# EAGLE schematic SchematicMasterModulePCB (EAGLE 9.7.0)
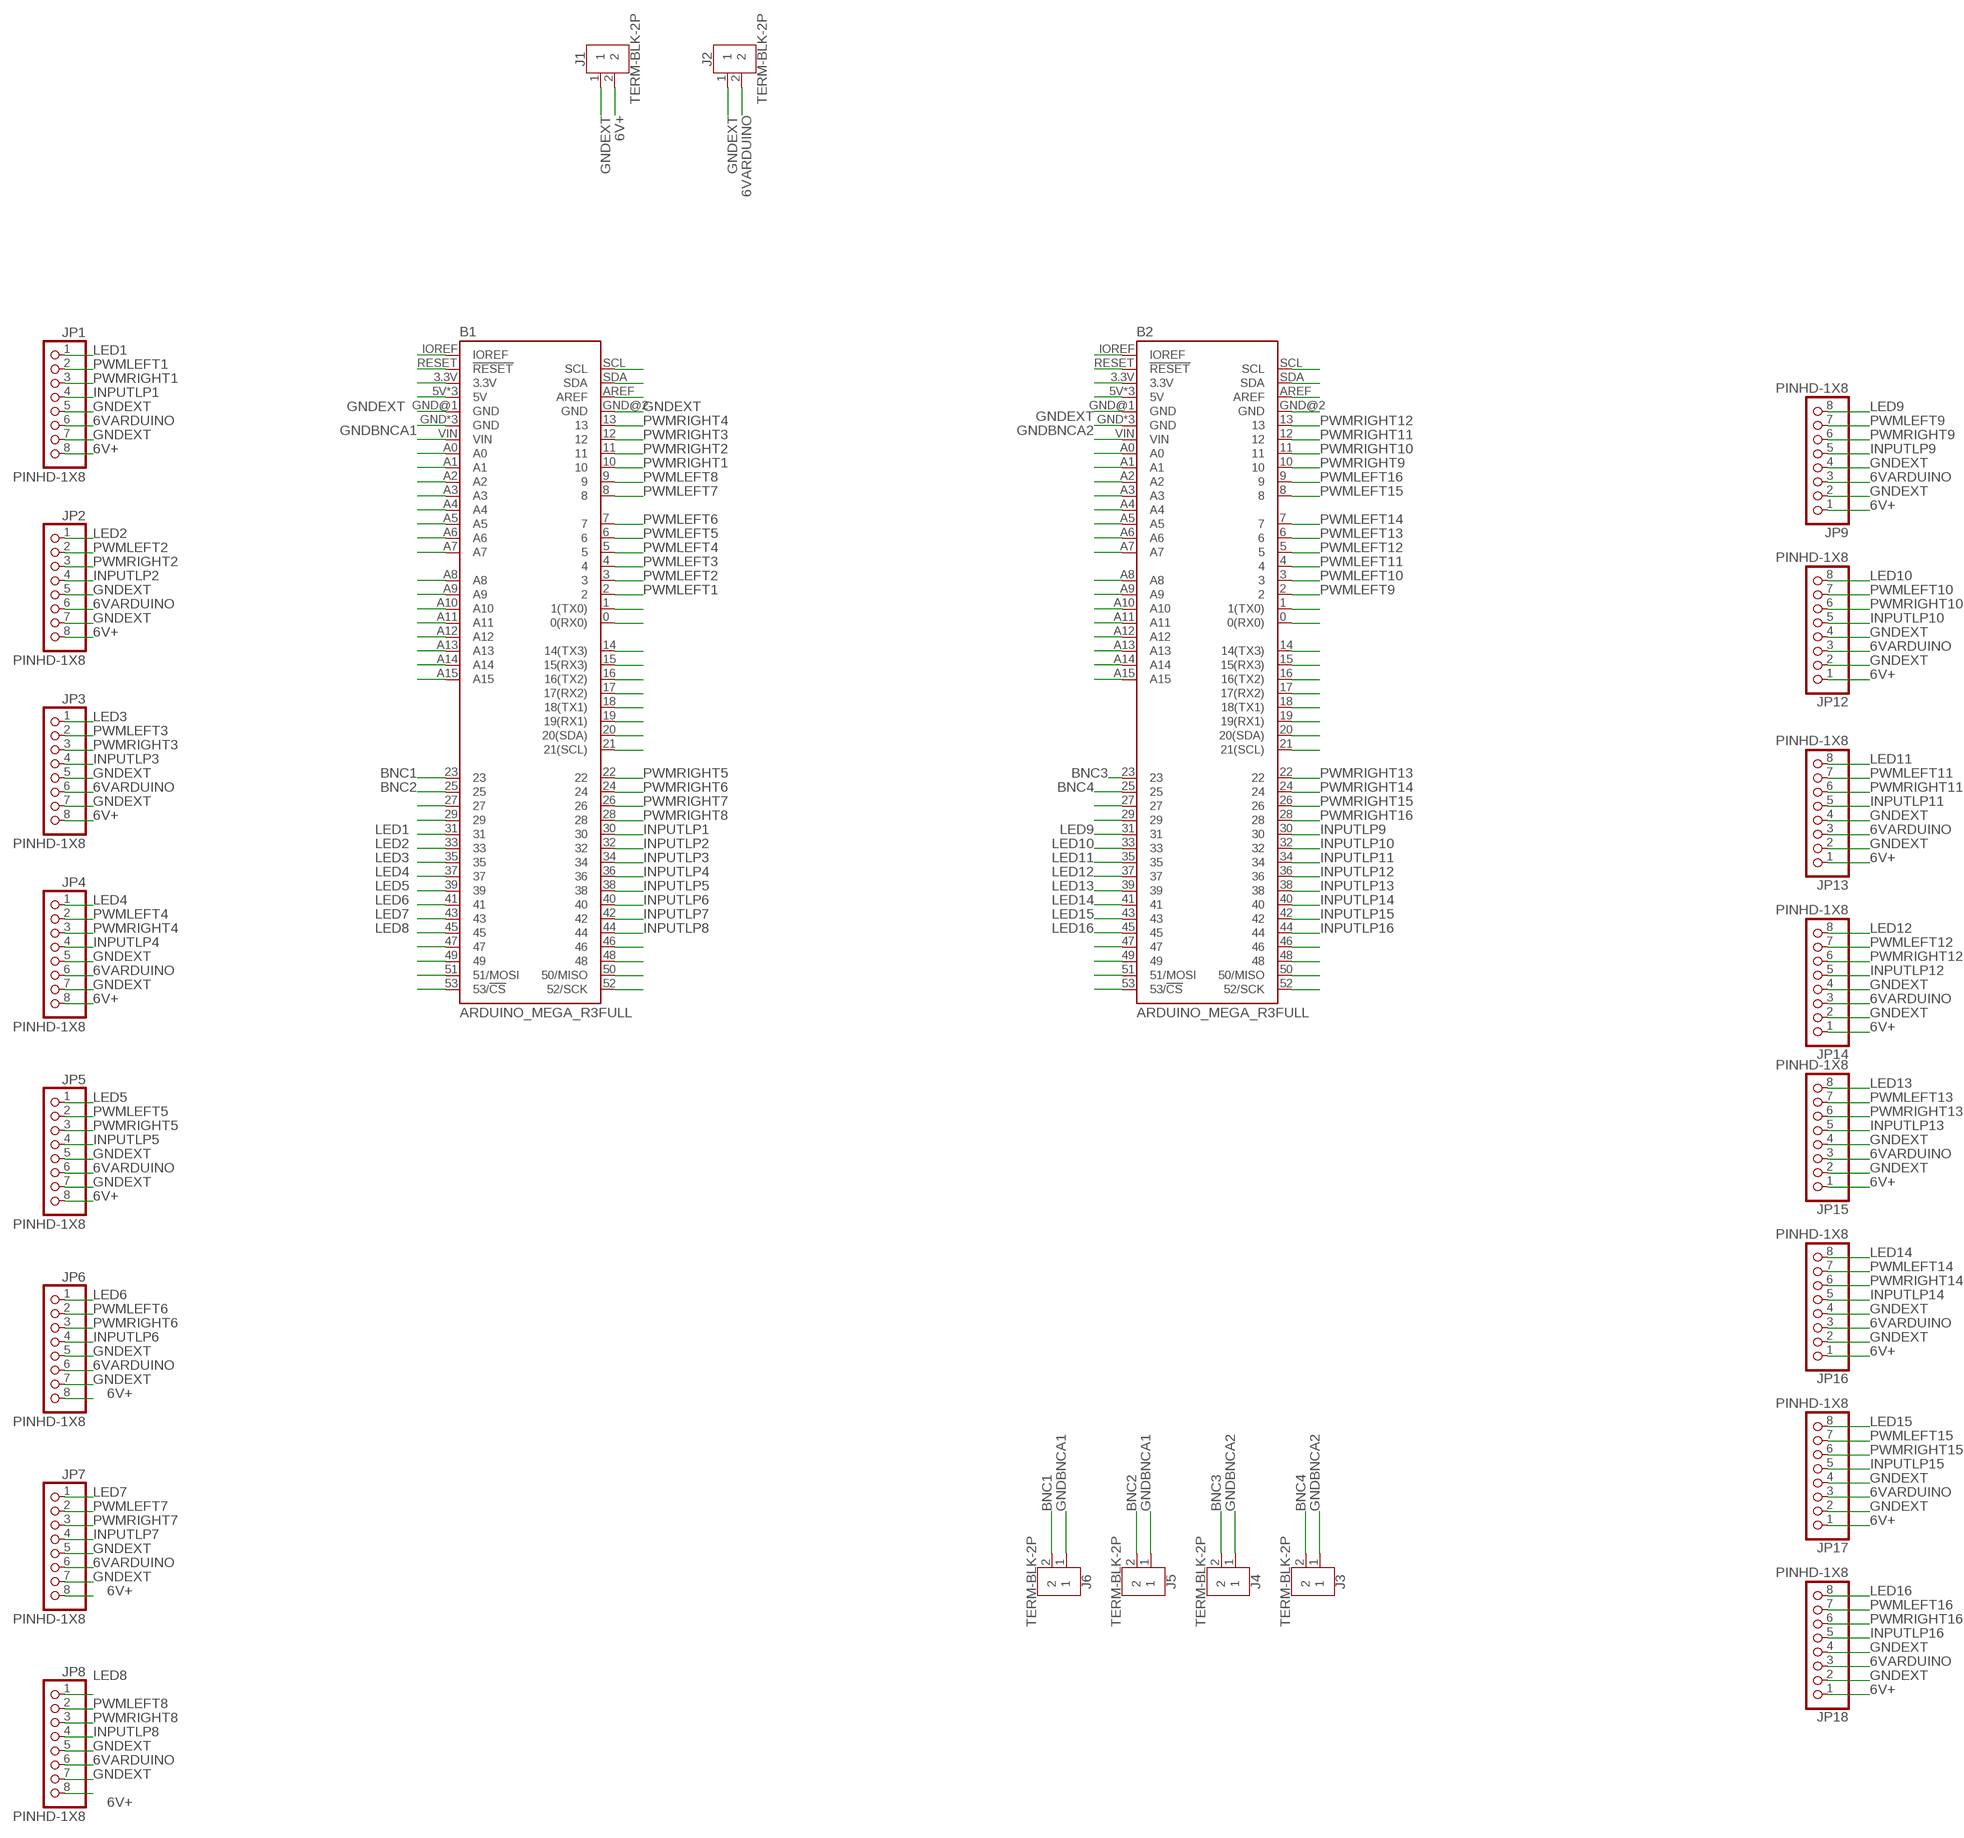
[diagram p0: schematic, sheet 1]

## Parts
B1  ARDUINO_MEGA_R3FULL  [ARDUINO_MEGA_NO_SILK]
B2  ARDUINO_MEGA_R3FULL  [ARDUINO_MEGA_NO_SILK]
J1  TERM-BLK-2P  2PINSCREWTERMINAL282837-2  [TERMBLK_508-2N]
J2  TERM-BLK-2P  2PINSCREWTERMINAL282837-2  [TERMBLK_508-2N]
J3  TERM-BLK-2P  2PINSCREWTERMINAL282837-2  [TERMBLK_508-2N]
J4  TERM-BLK-2P  2PINSCREWTERMINAL282837-2  [TERMBLK_508-2N]
J5  TERM-BLK-2P  2PINSCREWTERMINAL282837-2  [TERMBLK_508-2N]
J6  TERM-BLK-2P  2PINSCREWTERMINAL282837-2  [TERMBLK_508-2N]
JP1  PINHD-1X8  [1X08]
JP2  PINHD-1X8  [1X08]
JP3  PINHD-1X8  [1X08]
JP4  PINHD-1X8  [1X08]
JP5  PINHD-1X8  [1X08]
JP6  PINHD-1X8  [1X08]
JP7  PINHD-1X8  [1X08]
JP8  PINHD-1X8  [1X08]
JP9  PINHD-1X8  [1X08]
JP12  PINHD-1X8  [1X08]
JP13  PINHD-1X8  [1X08]
JP14  PINHD-1X8  [1X08]
JP15  PINHD-1X8  [1X08]
JP16  PINHD-1X8  [1X08]
JP17  PINHD-1X8  [1X08]
JP18  PINHD-1X8  [1X08]

## Nets
6V+: J1.2 JP1.8 JP2.8 JP3.8 JP4.8 JP5.8 JP6.8 JP7.8 JP8.8 JP9.1 JP12.1 JP13.1 JP14.1 JP15.1 JP16.1 JP17.1 JP18.1
6VARDUINO: J2.2 JP1.6 JP2.6 JP3.6 JP4.6 JP5.6 JP6.6 JP7.6 JP8.6 JP9.3 JP12.3 JP13.3 JP14.3 JP15.3 JP16.3 JP17.3 JP18.3
BNC1: B1.23 J6.2
BNC2: B1.25 J5.2
BNC3: B2.23 J4.2
BNC4: B2.25 J3.2
GNDBNCA1: B1.GND B1.GND@3(GND) B1.GND@4(GND) J5.1 J6.1
GNDBNCA2: B2.GND B2.GND@3(GND) B2.GND@4(GND) J3.1 J4.1
GNDEXT: B1.GND@1(GND) B1.GND@2(GND) B2.GND@1(GND) J1.1 J2.1 JP1.5 JP1.7 JP2.5 JP2.7 JP3.5 JP3.7 JP4.5 JP4.7 JP5.5 JP5.7 JP6.5 JP6.7 JP7.5 JP7.7 JP8.5 JP8.7 JP9.2 JP9.4 JP12.2 JP12.4 JP13.2 JP13.4 JP14.2 JP14.4 JP15.2 JP15.4 JP16.2 JP16.4 JP17.2 JP17.4 JP18.2 JP18.4
INPUTLP1: B1.30 JP1.4
INPUTLP2: B1.32 JP2.4
INPUTLP3: B1.34 JP3.4
INPUTLP4: B1.36 JP4.4
INPUTLP5: B1.38 JP5.4
INPUTLP6: B1.40 JP6.4
INPUTLP7: B1.42 JP7.4
INPUTLP8: B1.44 JP8.4
INPUTLP9: B2.30 JP9.5
INPUTLP10: B2.32 JP12.5
INPUTLP11: B2.34 JP13.5
INPUTLP12: B2.36 JP14.5
INPUTLP13: B2.38 JP15.5
INPUTLP14: B2.40 JP16.5
INPUTLP15: B2.42 JP17.5
INPUTLP16: B2.44 JP18.5
LED1: B1.31 JP1.1
LED2: B1.33 JP2.1
LED3: B1.35 JP3.1
LED4: B1.37 JP4.1
LED5: B1.39 JP5.1
LED6: B1.41 JP6.1
LED7: B1.43 JP7.1
LED8: B1.45 JP8.1
LED9: B2.31 JP9.8
LED10: B2.33 JP12.8
LED11: B2.35 JP13.8
LED12: B2.37 JP14.8
LED13: B2.39 JP15.8
LED14: B2.41 JP16.8
LED15: B2.43 JP17.8
LED16: B2.45 JP18.8
N$1: B2.IOREF
N$2: B2.RESET(!RESET)
N$3: B2.3.3V
N$4: B2.5V B2.5V@1(5V) B2.5V@2(5V)
N$7: B2.VIN
N$8: B2.A0
N$9: B2.A1
N$10: B1.IOREF
N$11: B2.A2
N$12: B2.A3
N$13: B2.A4
N$14: B2.A5
N$15: B2.A6
N$16: B2.A7
N$17: B2.A8
N$18: B1.RESET(!RESET)
N$19: B2.A9
N$20: B2.A10
N$21: B2.A11
N$22: B2.A12
N$23: B2.A13
N$24: B2.A14
N$25: B2.A15
N$26: B1.3.3V
N$29: B2.27
N$30: B2.29
N$35: B1.5V B1.5V@1(5V) B1.5V@2(5V)
N$40: B2.47
N$41: B2.49
N$42: B2.51(51/MOSI)
N$43: B2.53(53/!CS)
N$44: B2.52(52/SCK)
N$45: B2.50(50/MISO)
N$46: B2.48
N$47: B2.46
N$59: B1.VIN
N$62: B2.21(21(SCL))
N$63: B2.20(20(SDA))
N$64: B2.19(19(RX1))
N$65: B2.18(18(TX1))
N$66: B2.17(17(RX2))
N$67: B1.A0
N$68: B1.A1
N$69: B1.A2
N$70: B1.A3
N$71: B1.A4
N$72: B1.A5
N$73: B1.A6
N$74: B1.A7
N$75: B1.A8
N$76: B1.A9
N$77: B1.A10
N$78: B1.A11
N$79: B1.A12
N$80: B1.A13
N$81: B1.A14
N$82: B1.A15
N$85: B1.27
N$86: B1.29
N$95: B1.47
N$96: B1.49
N$97: B1.51(51/MOSI)
N$98: B1.53(53/!CS)
N$99: B1.SCL
N$100: B1.SDA
N$101: B1.AREF
N$102: B2.16(16(TX2))
N$103: B2.15(15(RX3))
N$104: B2.14(14(TX3))
N$105: B2.0(0(RX0))
N$106: B2.1(1(TX0))
N$114: B1.1(1(TX0))
N$115: B1.0(0(RX0))
N$116: B1.14(14(TX3))
N$117: B1.15(15(RX3))
N$118: B1.16(16(TX2))
N$119: B1.17(17(RX2))
N$120: B1.18(18(TX1))
N$121: B1.19(19(RX1))
N$122: B1.20(20(SDA))
N$123: B1.21(21(SCL))
N$136: B1.46
N$137: B1.48
N$138: B1.50(50/MISO)
N$139: B1.52(52/SCK)
N$145: B2.GND@2(GND)
N$146: B2.AREF
N$147: B2.SDA
N$148: B2.SCL
PWMLEFT1: B1.2 JP1.2
PWMLEFT2: B1.3 JP2.2
PWMLEFT3: B1.4 JP3.2
PWMLEFT4: B1.5 JP4.2
PWMLEFT5: B1.6 JP5.2
PWMLEFT6: B1.7 JP6.2
PWMLEFT7: B1.8 JP7.2
PWMLEFT8: B1.9 JP8.2
PWMLEFT9: B2.2 JP9.7
PWMLEFT10: B2.3 JP12.7
PWMLEFT11: B2.4 JP13.7
PWMLEFT12: B2.5 JP14.7
PWMLEFT13: B2.6 JP15.7
PWMLEFT14: B2.7 JP16.7
PWMLEFT15: B2.8 JP17.7
PWMLEFT16: B2.9 JP18.7
PWMRIGHT1: B1.10 JP1.3
PWMRIGHT2: B1.11 JP2.3
PWMRIGHT3: B1.12 JP3.3
PWMRIGHT4: B1.13 JP4.3
PWMRIGHT5: B1.22 JP5.3
PWMRIGHT6: B1.24 JP6.3
PWMRIGHT7: B1.26 JP7.3
PWMRIGHT8: B1.28 JP8.3
PWMRIGHT9: B2.10 JP9.6
PWMRIGHT10: B2.11 JP12.6
PWMRIGHT11: B2.12 JP13.6
PWMRIGHT12: B2.13 JP14.6
PWMRIGHT13: B2.22 JP15.6
PWMRIGHT14: B2.24 JP16.6
PWMRIGHT15: B2.26 JP17.6
PWMRIGHT16: B2.28 JP18.6

## Library data of the parts
B1 B2 = MasterModuleLibrary:ARDUINO_MEGA_R3: Arduino Mega R3 ATmega2560 R3 compatible footprint. SparkFun Products: Arduino Mega 2560 R3 <https://www.sparkfun.com/products/11061>
J1-J6 = MasterModuleLibrary:2PINSCREWTERMINAL: 2 Position Wire to Board Terminal Block Horizontal with Board Datasheet <https://www.te.com.cn/commerce/DocumentDelivery/DDEController?Action=showdoc&DocId=Catalog+Section%7F1308389_EUROSTYLE_TERMINAL_BLOCKS%7F0607%7Fpdf%7FEnglish%7FENG_CS_1308389_EUROSTYLE_TERMINAL_BLOCKS_0607.pdf%7F2-282837-5>; CATEGORY: Fixed Terminal Blocks; DESCRIPTION: Fixed Terminal Blocks 5.08MM PCB MOUNT 2P; MANUFACTURER: TE Connectivity AMP Connectors; MPN: 282837-2; OPERATING_TEMPERATURE: -40°C to +105°C; PART_STATUS: ACTIVE; PITCH: 0.200" (5.08mm); ROHS_COMPLIANCE: RoHS Compliant; SERIES: Buchanan; SUBCATEGORY: Terminal Blocks; TYPE: Through Hole; Screw - Rising Cage Clamp; Side wire entry, Horizontal with Board
JP1-JP9 JP12-JP18 = MasterModuleLibrary:PINHD-1X8: PIN HEADER; CATEGORY: Headers; DESCRIPTION: Header, Straight, 8 Position; MANUFACTURER: Generic; MPN: Generic; OPERATING_TEMPERATURE: Generic; PART_STATUS: Active; PITCH: 0.100" (2.54mm); ROHS_COMPLIANCE: Generic; SERIES: Generic; SUB-CATEGORY: Headers, Male Pins; TYPE: Board to Board or Cable, Unshrouded, Through Hole, Straight